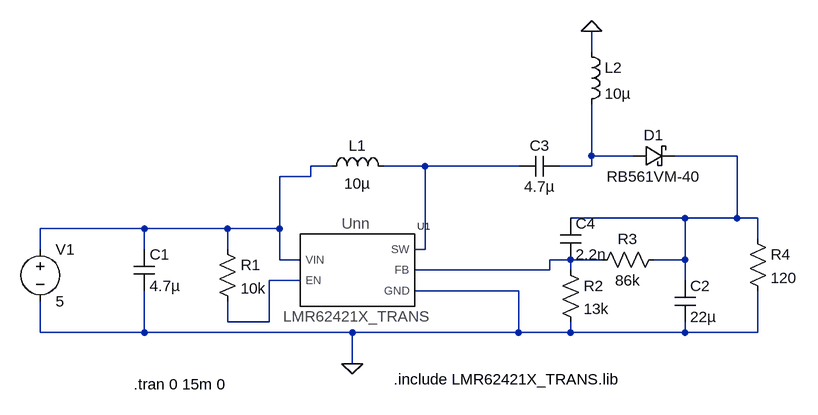
[diagram p0: schematic TI_LMR62421X_sepic.asc]
TI_LMR62421X_sepic.asc, the LTspice schematic file:
Version 4
SHEET 1 880 680
WIRE 528 -176 528 -208
WIRE 528 -16 528 -96
WIRE 592 -16 528 -16
WIRE 752 -16 656 -16
WIRE 128 0 96 0
WIRE 272 0 208 0
WIRE 416 0 272 0
WIRE 528 0 528 -16
WIRE 528 0 480 0
WIRE 96 16 96 0
WIRE 96 16 48 16
WIRE 672 80 496 80
WIRE 752 80 752 -16
WIRE 752 80 672 80
WIRE 784 80 752 80
WIRE -160 96 -320 96
WIRE -32 96 -160 96
WIRE 48 96 48 16
WIRE 48 96 -32 96
WIRE 784 112 784 80
WIRE -320 128 -320 96
WIRE -160 128 -160 96
WIRE -32 128 -32 96
WIRE 272 128 272 0
WIRE 272 128 256 128
WIRE 48 144 48 96
WIRE 80 144 48 144
WIRE 496 144 464 144
WIRE 544 144 496 144
WIRE 672 144 672 80
WIRE 672 144 624 144
WIRE 464 160 464 144
WIRE 464 160 256 160
WIRE 496 160 496 144
WIRE 80 176 32 176
WIRE 672 176 672 144
WIRE 416 192 256 192
WIRE -32 240 -32 208
WIRE 32 240 32 176
WIRE 32 240 -32 240
WIRE -320 256 -320 208
WIRE -160 256 -160 192
WIRE -160 256 -320 256
WIRE 160 256 -160 256
WIRE 416 256 416 192
WIRE 416 256 160 256
WIRE 496 256 496 240
WIRE 496 256 416 256
WIRE 672 256 672 240
WIRE 672 256 496 256
WIRE 784 256 784 192
WIRE 784 256 672 256
WIRE 160 304 160 256
FLAG 160 304 0
FLAG 528 -208 0
SYMBOL res -48 112 R0
SYMATTR InstName R1
SYMATTR Value 10k
SYMBOL cap -176 128 R0
SYMATTR InstName C1
SYMATTR Value 4.7µ
SYMBOL ind 112 16 R270
WINDOW 0 32 56 VTop 2
WINDOW 3 5 56 VBottom 2
SYMATTR InstName L1
SYMATTR Value 10µ
SYMBOL schottky 592 0 R270
WINDOW 0 32 32 VTop 2
WINDOW 3 0 32 VBottom 2
SYMATTR InstName D1
SYMATTR Value RB561VM-40
SYMATTR Description Diode
SYMATTR Type diode
SYMBOL res 480 144 R0
SYMATTR InstName R2
SYMATTR Value 13k
SYMBOL res 640 128 R90
WINDOW 0 0 56 VBottom 2
WINDOW 3 32 56 VTop 2
SYMATTR InstName R3
SYMATTR Value 86k
SYMBOL cap 656 176 R0
SYMATTR InstName C2
SYMATTR Value 22µ
SYMBOL res 768 96 R0
SYMATTR InstName R4
SYMATTR Value 120
SYMBOL voltage -320 112 R0
WINDOW 123 0 0 Left 0
WINDOW 39 0 0 Left 0
SYMATTR InstName V1
SYMATTR Value 5
SYMBOL cap 480 -16 R90
WINDOW 0 0 32 VBottom 2
WINDOW 3 32 32 VTop 2
SYMATTR InstName C3
SYMATTR Value 4.7µ
SYMBOL ind 512 -192 R0
SYMATTR InstName L2
SYMATTR Value 10µ
SYMBOL cap 480 80 R0
SYMATTR InstName C4
SYMATTR Value 2.2n
SYMBOL LMR62421X_TRANS 160 160 R0
SYMATTR InstName U1
TEXT -176 336 Left 2 !.tran 0 15m 0
TEXT 224 328 Left 2 !.include LMR62421X_TRANS.lib

The netlist it stands for:
* TI_LMR62421X_sepic.asc
R1 N003 N006 10k
C1 N003 0 4.7µ
L1 N003 N004 10µ
D1 N001 N002 RB561VM-40
R2 N005 0 13k
R3 N002 N005 86k
C2 N002 0 22µ
R4 N002 0 120
V1 N003 0 5
C3 N001 N004 4.7µ
L2 0 N001 10µ
C4 N002 N005 2.2n
XU1 N003 N006 N004 N005 0 LMR62421X_TRANS  ; pins VIN EN SW FB GND
.model D D
.lib standard.dio
.tran 0 15m 0
.include LMR62421X_TRANS.lib
.backanno
.end